# Altium schematic sheet motordriver-v5.0_LC-filter.SchDoc
size A4; SheetNumber: 9; SheetTotal: 9
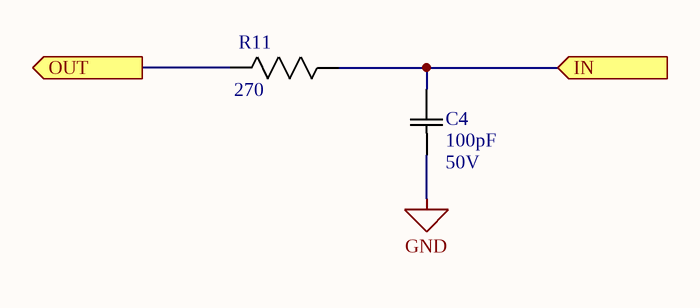
[diagram p0: motordriver-v5.0_LC-filter.SchDoc]

## Parts
C4  Rating: 50V  [0603]  (hidden comment: 100pF)
R11  270  [0603]

## Ports
IN (in), OUT (out)

## Nets
GND: C4.1(C1)
IN: C4.2(C2) R11.1(R1) ; port IN
OUT: R11.2(R2) ; port OUT

## Library data of the parts
C4 = CAP 100pF 50V: CAP CER 100PF 50V X7R 0603/0805; Tolerance: 10%; Package: 0603/0805; Temperature Coefficient: X7R; Operating Temperature: -55°C ~ 125°C; Value: 100pF
R11 = RES 270.0 1/8W - 1%: RES SMD 270 OHM 1% 1/8W 0603/0805; Power (Watts): 0.125W; Package: 0805; Value: 270; Tolerance: 1%